# Altium schematic sheet SPI-4B触摸.SCHDOC
size A4; PageSetup: Record=PageOptions|CenterHorizontal=True|CenterVertical=True|PrintScale=0.96|XCorrection=1.00|YCorrection=1.00|PrintKind=2|BorderSize=5000000|LeftOffset=0|BottomOffset=0|Orientation=2|PaperLength=1000|PaperWidth=1000|Scale=100|PaperSource=7|PrintQuality=-4|MediaType=1|DitherType=10|PaperKind=A4|PrintScaleMode=1
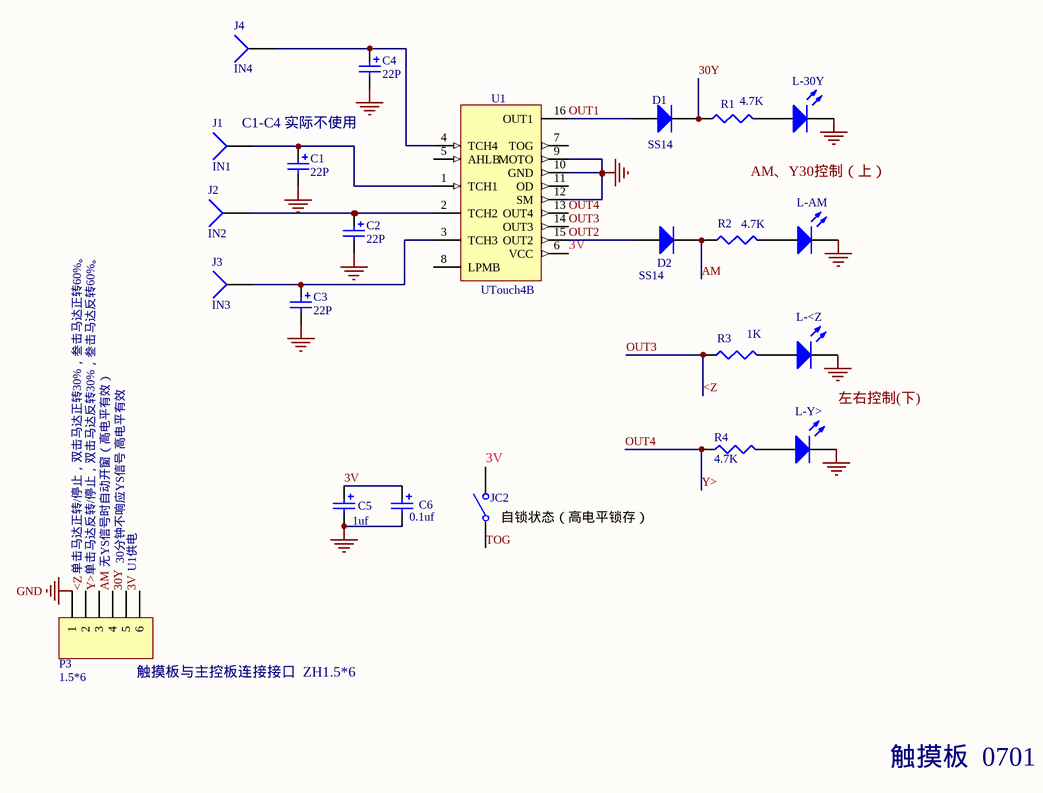
[diagram p0: SPI-4B触摸.SCHDOC]

## Parts
C1  value 22P  [CC2012-0805]
C2  value 22P  [CC2012-0805]
C3  value 22P  [CC2012-0805]
C4  value 22P  [CC2012-0805]
C5  1uf  [CC2012-0805]
C6  0.1uf  [CC2012-0805]
D1  SS14  [DIO7.1-3.9x1.9]
D2  SS14  [DIO7.1-3.9x1.9]
J1  IN1  [PIN1]
J2  IN2  [PIN1]
J3  IN3  [PIN1]
J4  IN4  [PIN1]
JC2  自锁状态（高电平锁存）  [SPST-2]
L-30Y  (no value)  [SMD _LED]
L-<Z  (no value)  [SMD _LED]
L-AM  (no value)  [SMD _LED]
L-Y>  (no value)  [SMD _LED]
P3  1.5*6  [MHDR1X6]
R1  4.7K  [C1608-0603]
R2  4.7K  [C1608-0603]
R3  value 1K  [C1608-0603]
R4  4.7K  [C1608-0603]
U1  UTouch4B  [TSSO5x6-G16]

## Nets
GND: C1.2 C2.2 C3.2 C4.2 C5.2 C6.2 L-30Y.2(K) L-<Z.2(K) L-AM.2(K) L-Y>.2(K) P3.1 U1.9(MOTO) U1.10(GND) U1.12(SM)
3V: C5.1 C6.1 JC2.2(NO) P3.6 U1.6(VCC)
30Y: D1.2(K) P3.5 R1.1
<Z: P3.2 R3.1 U1.14(OUT3)  [also labelled OUT3]
AM: D2.2(K) P3.4 R2.1
OUT1: D1.1(A) U1.16(OUT1)
OUT2: D2.1(A) U1.15(OUT2)
OUT4: P3.3 R4.1 U1.13(OUT4)  [also labelled Y>]
TOG: JC2.2(COMMON)
NetC1_1: C1.1 J1.1 U1.1(TCH1)
NetC2_1: C2.1 J2.1 U1.2(TCH2)
NetC3_1: C3.1 J3.1 U1.3(TCH3)
NetC4_1: C4.1 J4.1 U1.4(TCH4)
NetL-30Y_1: L-30Y.1(A) R1.2
NetL-<Z_1: L-<Z.1(A) R3.2
NetL-AM_1: L-AM.1(A) R2.2
NetL-Y>_1: L-Y>.1(A) R4.2

Not connected (* = marked no-connect by the designer): U1 5(AHLB) 7(TOG) 8(LPMB) 11(OD)

## Notes on the sheet
- C1-C4 实际不使用
- (near P3) 无YS信号时自动开窗（高电平有效）
- 30分钟不响应YS信号 高电平有效
- (near P3) U1供电
- (near P3) 单击马达正转/停止，双击马达正转30%，叁击马达正转60%。
- (near P3) 单击马达反转/停止，双击马达反转30%，叁击马达反转60%。
- (near P3) 触摸板与主控板连接接口  ZH1.5*6
- 触摸板  0701
- Labels drawn without touching a wire or pin: AM、Y30控制（上）, 左右控制(下)

## Library data of the parts
C1-C6 = Cap Pol3: Polarized Capacitor (Surface Mount); Published: 8-Jun-2000; LatestRevisionDate: 17-Jul-2002; LatestRevisionNote: Re-released for DXP Platform.; Publisher: Altium Limited; PackageReference: C0805
D1 D2 = Diode 1N914: High Conductance Fast Diode; Published: 8-Jun-2000; LatestRevisionDate: 17-Jul-2002; LatestRevisionNote: Re-released for DXP Platform.; Publisher: Altium Limited; PackageReference: DO-35; DatasheetDocument: 1997; Code_JEDEC: DO-204-AH
J1-J4 = Socket: LatestRevisionDate: 17-Jul-2002; LatestRevisionNote: Re-released for DXP Platform.; Publisher: Altium Limited
JC2 = SW-SPST: Single-Pole, Single-Throw Switch; Published: 24-Mar-1999; LatestRevisionDate: 17-Jul-2002; LatestRevisionNote: Re-released for DXP Platform.; Publisher: Altium Limited
L-30Y L-<Z L-AM L-Y> = LED3: Typical BLUE SiC LED; Published: 8-Jun-2000; LatestRevisionDate: 17-Dec-2003; LatestRevisionNote: PCB Footprint replaced.; Publisher: Altium Limited
P3 = MHDR1X6: Header, 6-Pin; LatestRevisionDate: 17-Jul-2002; LatestRevisionNote: Re-released for DXP Platform.; Publisher: Altium Limited
R1-R4 = Res3: Resistor; Published: 8-Jun-2000; LatestRevisionDate: 17-Jul-2002; LatestRevisionNote: Re-released for DXP Platform.; Publisher: Altium Limited
U1 = ADC-8: Generic 8-Bit A/D Converter; Published: 8-Jun-2000; LatestRevisionDate: 17-Jul-2002; LatestRevisionNote: Re-released for DXP Platform.; Publisher: Altium Limited; Code_JEDEC: MO-153-AB